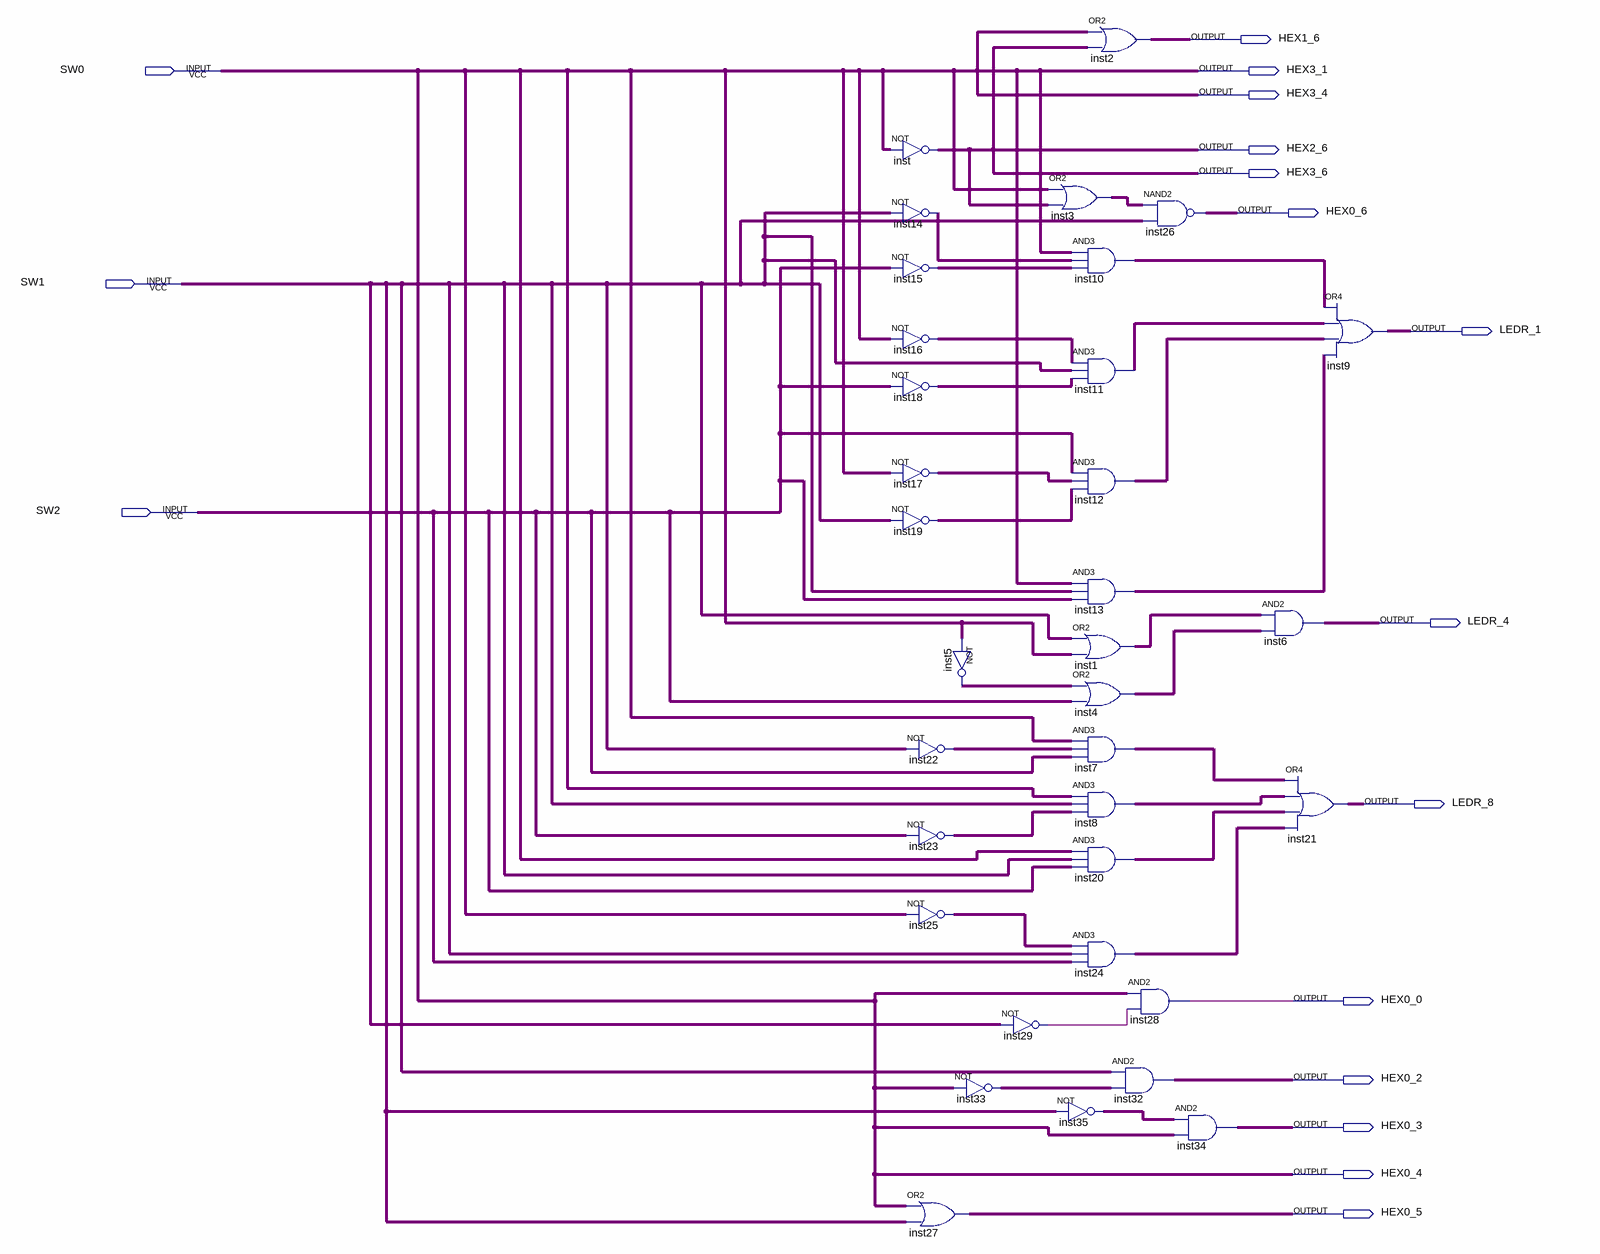
[diagram p0: schematic sheet]
// Quartus schematic L1C580.bdf as structural Verilog: 34 symbols, 17 pins
module L1C580 (
  input  SW0,
  input  SW1,
  input  SW2,
  output HEX1_6,
  output HEX3_1,
  output HEX3_4,
  output HEX2_6,
  output HEX3_6,
  output HEX0_6,
  output LEDR_1,
  output LEDR_4,
  output LEDR_8,
  output HEX0_0,
  output HEX0_2,
  output HEX0_3,
  output HEX0_4,
  output HEX0_5
);

  wire inst1_out, inst3_out, inst4_out, inst5_out, inst7_out, inst8_out, inst10_out, inst11_out, inst12_out,
       inst13_out, inst14_out, inst15_out, inst16_out, inst17_out, inst18_out, inst19_out, inst20_out,
       inst22_out, inst23_out, inst24_out, inst25_out, inst29_out, inst33_out, inst35_out;

  not inst (HEX2_6, SW0);
  not inst14 (inst14_out, SW1);
  not inst15 (inst15_out, SW2);
  not inst16 (inst16_out, SW0);
  not inst18 (inst18_out, SW2);
  not inst17 (inst17_out, SW0);
  not inst19 (inst19_out, SW1);
  not inst5 (inst5_out, SW0);
  not inst22 (inst22_out, SW1);
  not inst23 (inst23_out, SW2);
  not inst25 (inst25_out, SW0);
  not inst33 (inst33_out, SW0);
  or inst27 (HEX0_5, SW0, SW1);
  not inst29 (inst29_out, SW1);
  or inst3 (inst3_out, SW0, HEX2_6);
  and inst10 (inst10_out, SW0, inst14_out, inst15_out);
  and inst11 (inst11_out, inst16_out, SW1, inst18_out);
  and inst12 (inst12_out, SW2, inst17_out, inst19_out);
  and inst13 (inst13_out, SW0, SW1, SW2);
  or inst1 (inst1_out, SW1, SW0);
  or inst4 (inst4_out, inst5_out, SW2);
  and inst7 (inst7_out, SW0, inst22_out, SW2);
  and inst8 (inst8_out, SW0, SW1, inst23_out);
  and inst20 (inst20_out, SW0, SW1, SW2);
  and inst24 (inst24_out, inst25_out, SW1, SW2);
  not inst35 (inst35_out, SW1);
  or inst2 (HEX1_6, SW0, HEX2_6);
  nand inst26 (HEX0_6, inst3_out, SW1);
  and inst28 (HEX0_0, SW0, inst29_out);
  and inst32 (HEX0_2, SW1, inst33_out);
  and inst34 (HEX0_3, inst35_out, SW0);
  and inst6 (LEDR_4, inst1_out, inst4_out);
  or inst9 (LEDR_1, inst10_out, inst11_out, inst12_out, inst13_out);
  or inst21 (LEDR_8, inst7_out, inst8_out, inst20_out, inst24_out);

  assign HEX0_4 = SW0;
  assign HEX3_1 = SW0;
  assign HEX3_4 = SW0;
  assign HEX3_6 = HEX2_6;
endmodule
